# Altium schematic sheet PD1_8.SchDoc: Sample Sheet Title
size B; Date: MM/DD/YYYY; Author: Sample Author; Organization: ORGANIZATION; Address1: ADDRESS 1; Address2: ADDRESS 2; Address3: ADDRESS 3; Address4: ADDRESS 4; Revision: -; SheetNumber: 1; SheetTotal: 1; ENG_APP_DATE: --/--/--; DSN_APP_DATE: --/--/--; CHK_APP_DATE: --/--/--
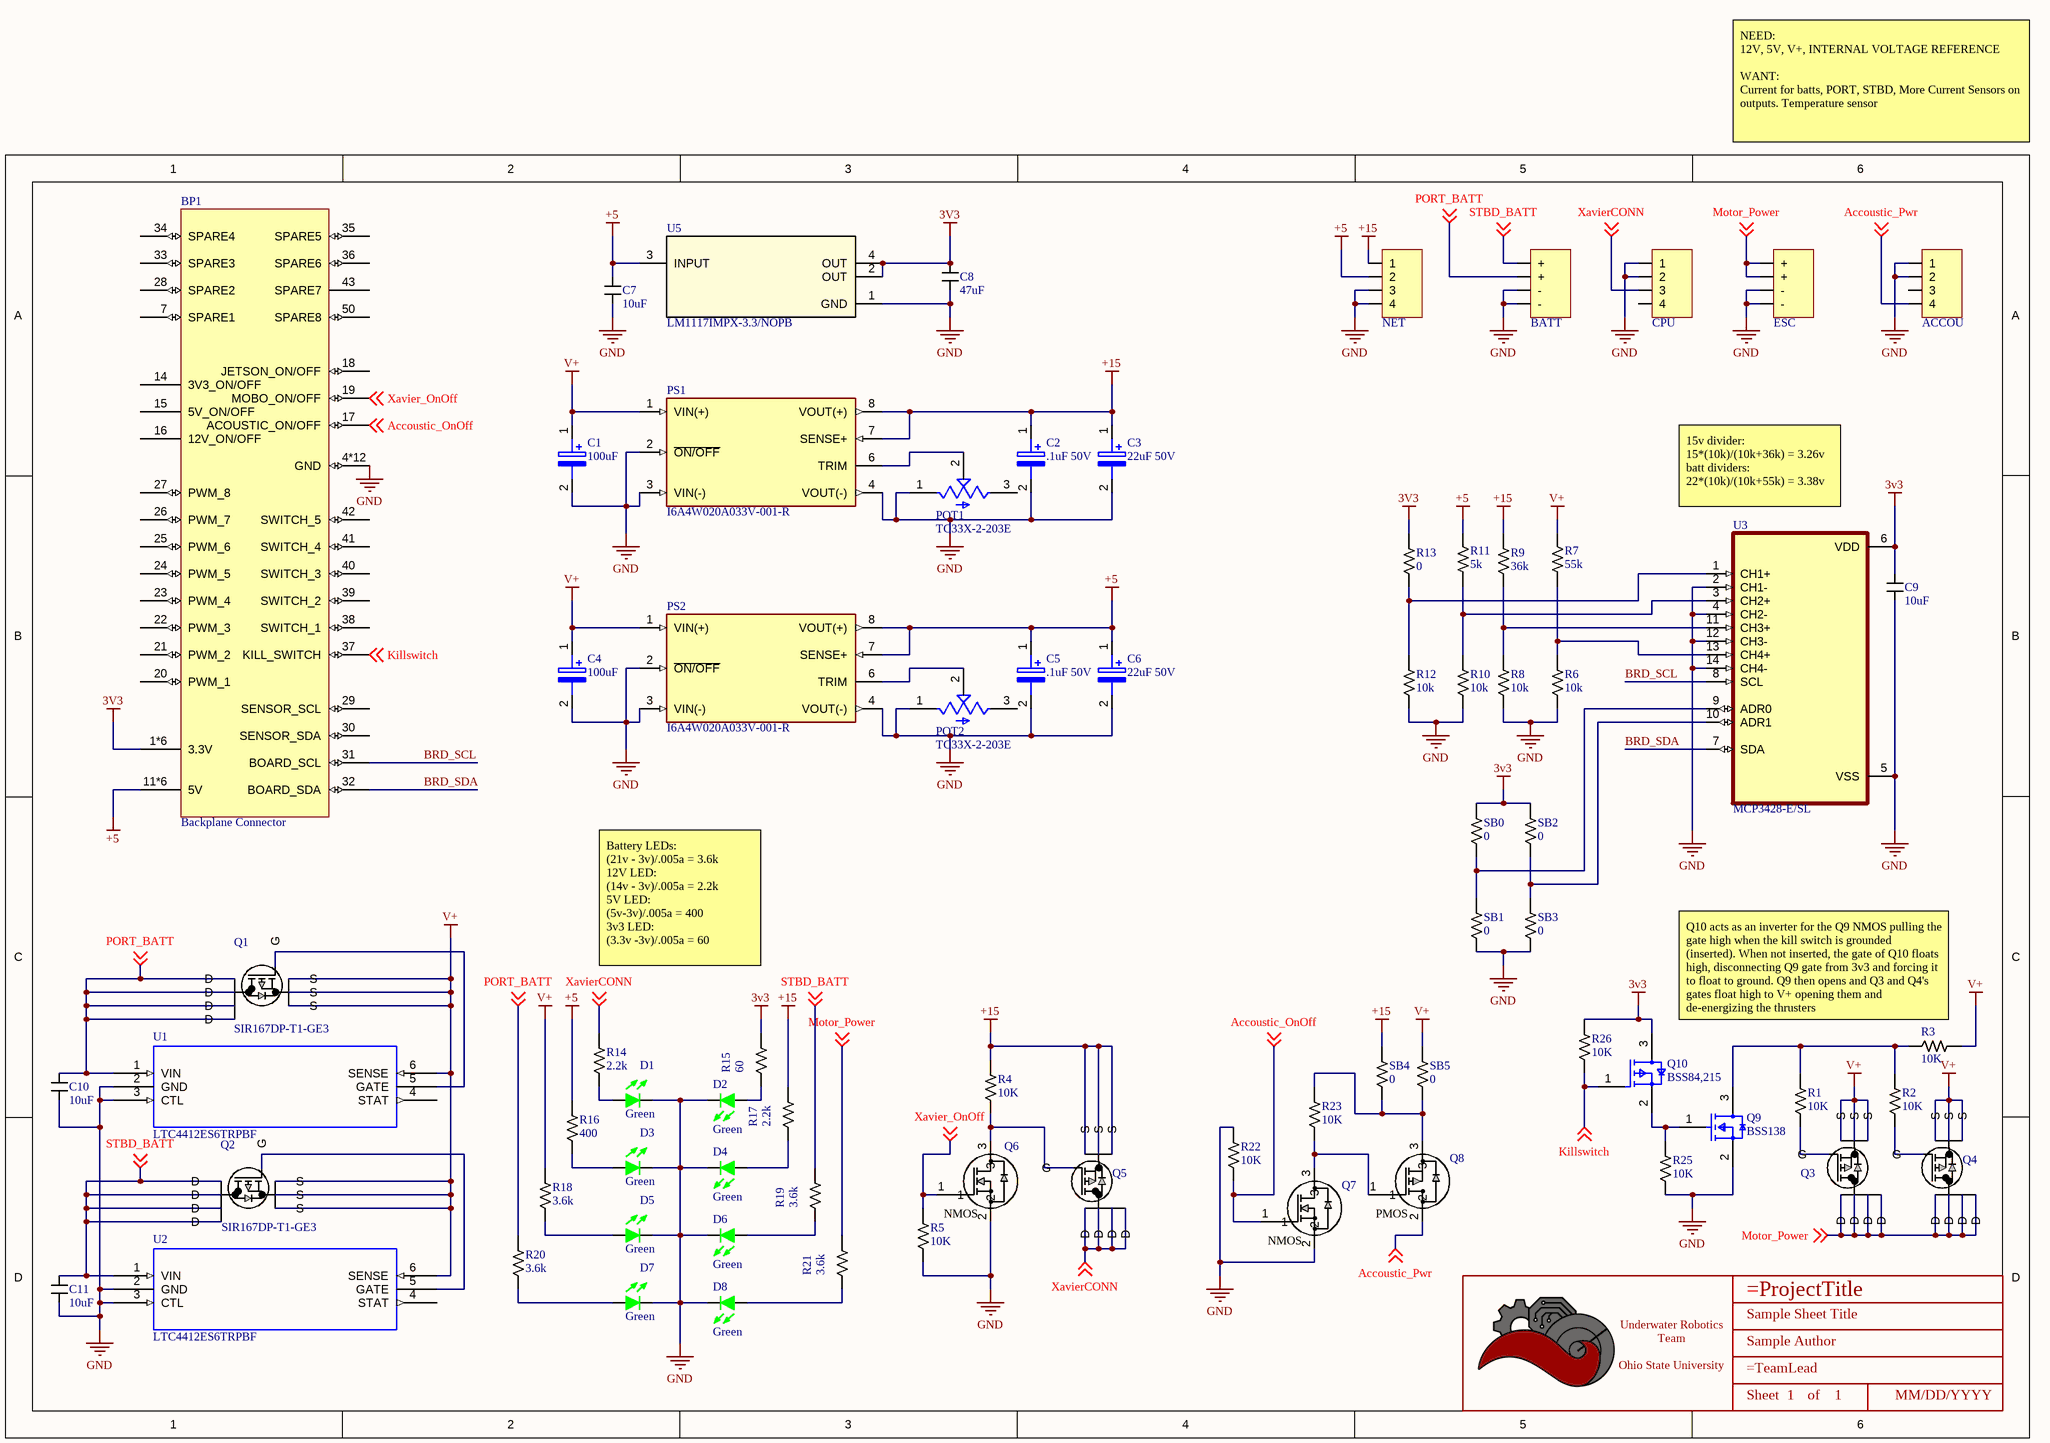
[diagram p0: PD1_8.SchDoc]

## Parts
*  Title_Block  [LOGO]  (value not drawn)  (graphical)
ACCOU  4 POS R/A  [CONN_MOLEX_MINIFIT JR_4 POS_R/A]  (value not drawn)
BATT  4 POS R/A  [CONN_ANDERSON_PP45_4 POS_R/A]  (value not drawn)
BP1  Backplane Connector  [BACKPLANE_EDGE_CONN]
C1  100uF  [CAPAE430X550N]
C2  .1uF 50V  [CAPAE430X550N]
C3  22uF 50V  [CAPAE430X550N]
C4  100uF  [CAPAE430X550N]
C5  .1uF 50V  [CAPAE430X550N]
C6  22uF 50V  [CAPAE430X550N]
C7  Value (uF): 10uF  [CAPACITOR_0603]  (hidden comment: 10uF Ceramic 6.3V)
C8  value 47uF  [CAPACITOR_0603]  (hidden comment: 47uF Ceramic 6.3V)
C9  Value (uF): 10uF  [CAPACITOR_0603]  (hidden comment: 10uF Ceramic 6.3V)
C10  Value (uF): 10uF  [CAPACITOR_0603]  (hidden comment: 10uF Ceramic 6.3V)
C11  Value (uF): 10uF  [CAPACITOR_0603]  (hidden comment: 10uF Ceramic 6.3V)
CPU  4 POS R/A  [CONN_MOLEX_MINIFIT JR_4 POS_R/A]  (value not drawn)
D1  Color: Green  [LED_0603]  (hidden comment: IN-S63AT5G)
D2  Color: Green  [LED_0603]  (hidden comment: IN-S63AT5G)
D3  Color: Green  [LED_0603]  (hidden comment: IN-S63AT5G)
D4  Color: Green  [LED_0603]  (hidden comment: IN-S63AT5G)
D5  Color: Green  [LED_0603]  (hidden comment: IN-S63AT5G)
D6  Color: Green  [LED_0603]  (hidden comment: IN-S63AT5G)
D7  Color: Green  [LED_0603]  (hidden comment: IN-S63AT5G)
D8  Color: Green  [LED_0603]  (hidden comment: IN-S63AT5G)
ESC  4 POS R/A  [CONN_ANDERSON_PP45_4 POS_R/A]  (value not drawn)
NET  4 POS R/A  [CONN_MOLEX_MINIFIT JR_4 POS_R/A]  (value not drawn)
POT1  TC33X-2-203E  [TRIM_TC33X-2-203E]
POT2  TC33X-2-203E  [TRIM_TC33X-2-203E]
PS1  I6A4W020A033V-001-R  [CONV_I6A4W020A033V-001-R]
PS2  I6A4W020A033V-001-R  [CONV_I6A4W020A033V-001-R]
Q1  SIR167DP-T1-GE3  [MOSFET_7DP-T1-GE3_VIS]
Q2  SIR167DP-T1-GE3  [MOSFET_7DP-T1-GE3_VIS]
Q3  SIR167DP-T1-GE3  [MOSFET_7DP-T1-GE3_VIS]  (value not drawn)
Q4  SIR167DP-T1-GE3  [MOSFET_7DP-T1-GE3_VIS]  (value not drawn)
Q5  SIR167DP-T1-GE3  [MOSFET_7DP-T1-GE3_VIS]  (value not drawn)
Q6  PMV13XNEAR  [SOT-23-3]  (value not drawn)
Q7  MOSFET N-Ch 20V 7.3A TO-236AB  [SOT-23-3]  (value not drawn)
Q8  MOSFET P-CHANNEL 20V 4.7A SOT23  [SOT-23-3]  (value not drawn)
Q9  BSS138  [FP-318-08-IPC_B]
Q10  BSS84,215  [FP-SOT23-MFG]
R1  Value  (Ohms): 10K  [RESISTOR_0603]  (hidden comment: 10k Ohm 5% 1/10W)
R2  Value  (Ohms): 10K  [RESISTOR_0603]  (hidden comment: 10k Ohm 5% 1/10W)
R3  Value  (Ohms): 10K  [RESISTOR_0603]  (hidden comment: 10k Ohm 5% 1/10W)
R4  Value  (Ohms): 10K  [RESISTOR_0603]  (hidden comment: 10k Ohm 5% 1/10W)
R5  Value  (Ohms): 10K  [RESISTOR_0603]  (hidden comment: 10k Ohm 5% 1/10W)
R6  Value  (Ohms): 10k  [RESISTOR_0603]  (hidden comment: 0 Ohm Jumper No Fit)
R7  Value  (Ohms): 55k  [RESISTOR_0603]  (hidden comment: 0 Ohm Jumper No Fit)
R8  Value  (Ohms): 10k  [RESISTOR_0603]  (hidden comment: 0 Ohm Jumper No Fit)
R9  Value  (Ohms): 36k  [RESISTOR_0603]  (hidden comment: 0 Ohm Jumper No Fit)
R10  Value  (Ohms): 10k  [RESISTOR_0603]  (hidden comment: 0 Ohm Jumper No Fit)
R11  Value  (Ohms): 5k  [RESISTOR_0603]  (hidden comment: 0 Ohm Jumper No Fit)
R12  Value  (Ohms): 10k  [RESISTOR_0603]  (hidden comment: 0 Ohm Jumper No Fit)
R13  Value  (Ohms): 0  [RESISTOR_0603]  (hidden comment: 0 Ohm Jumper No Fit)
R14  Value  (Ohms): 2.2k  [RESISTOR_0603]  (hidden comment: 0 Ohm Jumper No Fit)
R15  Value  (Ohms): 60  [RESISTOR_0603]  (hidden comment: 0 Ohm Jumper No Fit)
R16  Value  (Ohms): 400  [RESISTOR_0603]  (hidden comment: 0 Ohm Jumper No Fit)
R17  Value  (Ohms): 2.2k  [RESISTOR_0603]  (hidden comment: 0 Ohm Jumper No Fit)
R18  Value  (Ohms): 3.6k  [RESISTOR_0603]  (hidden comment: 0 Ohm Jumper No Fit)
R19  Value  (Ohms): 3.6k  [RESISTOR_0603]  (hidden comment: 0 Ohm Jumper No Fit)
R20  Value  (Ohms): 3.6k  [RESISTOR_0603]  (hidden comment: 0 Ohm Jumper No Fit)
R21  Value  (Ohms): 3.6k  [RESISTOR_0603]  (hidden comment: 0 Ohm Jumper No Fit)
R22  Value  (Ohms): 10K  [RESISTOR_0603]  (hidden comment: 10k Ohm 5% 1/10W)
R23  Value  (Ohms): 10K  [RESISTOR_0603]  (hidden comment: 10k Ohm 5% 1/10W)
R25  Value  (Ohms): 10K  [RESISTOR_0603]  (hidden comment: 10k Ohm 5% 1/10W)
R26  Value  (Ohms): 10K  [RESISTOR_0603]  (hidden comment: 10k Ohm 5% 1/10W)
SB0  Value  (Ohms): 0  [RESISTOR_0603]  (hidden comment: 0 Ohm Jumper No Fit)
SB1  Value  (Ohms): 0  [RESISTOR_0603]  (hidden comment: 0 Ohm Jumper No Fit)
SB2  Value  (Ohms): 0  [RESISTOR_0603]  (hidden comment: 0 Ohm Jumper No Fit)
SB3  Value  (Ohms): 0  [RESISTOR_0603]  (hidden comment: 0 Ohm Jumper No Fit)
SB4  Value  (Ohms): 0  [RESISTOR_0603]  (hidden comment: 0 Ohm Jumper No Fit)
SB5  Value  (Ohms): 0  [RESISTOR_0603]  (hidden comment: 0 Ohm Jumper No Fit)
U1  LTC4412ES6TRPBF  [TSOT-23_S6]
U2  LTC4412ES6TRPBF  [TSOT-23_S6]
U3  MCP3428-E/SL  [SOIC127P600X175-14N]
U5  LM1117IMPX-3.3/NOPB  [SOT-223-4]

## Nets
3V3: BP1.1*6(3.3V) C8.1 C9.1 Q10.3(D) R13.1 R15.1 R26.1 SB0.1 SB2.1 U3.6(VDD) U5.2(OUT) U5.4(OUT)
+5: BP1.11*6(5V) C5.1(POS) C6.1(POS) C7.1 NET.2 PS2.7(SENSE+) PS2.8(VOUT(+)) R11.2 R16.1 U5.3(INPUT)
+15: C2.1(POS) C3.1(POS) NET.1 PS1.7(SENSE+) PS1.8(VOUT(+)) Q5.1(S) Q5.2(S) Q5.3(S) R4.1 R9.1 R17.1 SB4.1
GND: ACCOU.1 ACCOU.2 BATT.3(-) BATT.4(-) BP1.4*12(GND) C1.2(NEG) C2.2(NEG) C3.2(NEG) C4.2(NEG) C5.2(NEG) C6.2(NEG) C7.2 C8.2 C9.2 C10.2 C11.2 CPU.1 CPU.2 D1.2 D2.2 D3.2 D4.2 D5.2 D6.2 D7.2 D8.2 ESC.3(-) ESC.4(-) NET.3 NET.4 POT1.1(CCW) POT2.1(CCW) PS1.2(~{ON/OFF}) PS1.3(VIN(-)) PS1.4(VOUT(-)) PS2.2(~{ON/OFF}) PS2.3(VIN(-)) PS2.4(VOUT(-)) Q6.2 Q7.2 Q9.2(S) R5.2 R6.2 R8.2 R10.2 R12.2 R22.1 R25.2 SB1.2 SB3.2 U1.2(GND) U1.3(CTL) U2.2(GND) U2.3(CTL) U3.2(CH1-) U3.4(CH2-) U3.5(VSS) U3.12(CH3-) U3.14(CH4-) U5.1(GND)
V+: C1.1(POS) C4.1(POS) PS1.1(VIN(+)) PS2.1(VIN(+)) Q1.1(S) Q1.2(S) Q1.3(S) Q2.1(S) Q2.2(S) Q2.3(S) Q3.1(S) Q3.2(S) Q3.3(S) Q4.1(S) Q4.2(S) Q4.3(S) R3.1 R7.2 R18.1 SB5.1 U1.6(SENSE) U2.6(SENSE)
Accoustic_OnOff: BP1.17(ACOUSTIC_ON/OFF) Q7.1 R22.2 ; off-sheet Accoustic_OnOff
Accoustic_Pwr: ACCOU.4 Q8.2 ; off-sheet Accoustic_Pwr
BRD_SCL: BP1.31(BOARD_SCL) U3.8(SCL)
BRD_SDA: BP1.32(BOARD_SDA) U3.7(SDA)
Killswitch: BP1.37(KILL_SWITCH) Q10.1(G) R26.2 ; off-sheet Killswitch
Motor_Power: ESC.1(+) ESC.2(+) Q3.5(D) Q3.6(D) Q3.7(D) Q3.8(D) Q4.5(D) Q4.6(D) Q4.7(D) Q4.8(D) R21.1 ; off-sheet Motor_Power
PORT_BATT: BATT.2(+) C10.1 Q1.5(D) Q1.6(D) Q1.7(D) Q1.8(D) R20.1 U1.1(VIN) ; off-sheet PORT_BATT
STBD_BATT: BATT.1(+) C11.1 Q2.5(D) Q2.6(D) Q2.7(D) Q2.8(D) R19.1 U2.1(VIN) ; off-sheet STBD_BATT
Xavier_OnOff: BP1.19(MOBO_ON/OFF) Q6.1 R5.1 ; off-sheet Xavier_OnOff
XavierCONN: CPU.3 Q5.5(D) Q5.6(D) Q5.7(D) Q5.8(D) R14.1 ; off-sheet XavierCONN
NetD1_1: D1.1 R14.2
NetD2_1: D2.1 R15.2
NetD3_1: D3.1 R16.2
NetD4_1: D4.1 R17.2
NetD5_1: D5.1 R18.2
NetD6_1: D6.1 R19.2
NetD7_1: D7.1 R20.2
NetD8_1: D8.1 R21.2
NetPOT1_2: POT1.2(W) PS1.6(TRIM)
NetPOT2_2: POT2.2(W) PS2.6(TRIM)
NetQ1_4: Q1.4(G) U1.5(GATE)
NetQ2_4: Q2.4(G) U2.5(GATE)
NetQ3_4: Q3.4(G) R1.2
NetQ4_4: Q4.4(G) R2.2
NetQ5_4: Q5.4(G) Q6.3 R4.2
NetQ7_3: Q7.3 Q8.1 R23.2
NetQ8_3: Q8.3 R23.1 SB4.2 SB5.2
NetQ9_1: Q9.1(G) Q10.2(S) R25.1
NetQ9_3: Q9.3(D) R1.1 R2.1 R3.2
NetR6_1: R6.1 R7.1 U3.13(CH4+)
NetR8_1: R8.1 R9.2 U3.11(CH3+)
NetR10_1: R10.1 R11.1 U3.3(CH2+)
NetR12_1: R12.1 R13.2 U3.1(CH1+)
NetSB0_2: SB0.2 SB1.1 U3.9(ADR0)
NetSB2_2: SB2.2 SB3.1 U3.10(ADR1)

Not connected (* = marked no-connect by the designer): ACCOU 3; BP1 7(SPARE1) 14(3V3_ON/OFF) 15(5V_ON/OFF) 16(12V_ON/OFF) 18(JETSON_ON/OFF) 20(PWM_1) 21(PWM_2) 22(PWM_3) 23(PWM_4) 24(PWM_5) 25(PWM_6) 26(PWM_7) 27(PWM_8) 28(SPARE2) 29(SENSOR_SCL) 30(SENSOR_SDA) 33(SPARE3) 34(SPARE4) 35(SPARE5) 36(SPARE6) 38(SWITCH_1) 39(SWITCH_2) 40(SWITCH_3) 41(SWITCH_4) 42(SWITCH_5) 43(SPARE7) 50(SPARE8); CPU 4; POT1 3(CW); POT2 3(CW); U1 4(STAT); U2 4(STAT)

## Notes on the sheet
- NEED:
  12V, 5V, V+, INTERNAL VOLTAGE REFERENCE
  WANT:
  Current for batts, PORT, STBD, More Current Sensors on outputs. Temperature sensor
- (near U3) 15v divider:
  15*(10k)/(10k+36k) = 3.26v
  batt dividers:
  22*(10k)/(10k+55k) = 3.38v
- Battery LEDs:
  (21v - 3v)/.005a = 3.6k
  12V LED:
  (14v - 3v)/.005a = 2.2k
  5V LED:
  (5v-3v)/.005a = 400
  3v3 LED:
  (3.3v -3v)/.005a = 60
- (near R3) Q10 acts as an inverter for the Q9 NMOS pulling the gate high when the kill switch is grounded (inserted). When not inserted, the gate of Q10 floats high, disconnecting Q9 gate from 3v3 and forcing it to float to ground. Q9 then opens and Q3 and Q4's gates float high to V+ opening them and de-energizing the thrusters
- DWG. NO.
- REV.
- SHT.
- THIS DOCUMENT AND THE DATA DISCLOSED HEREIN OR HEREWITH IS THE PROPERTY OF ALTIUM LIMITED AND MAY BE FREELY DISTRIBUTED IN WHOLE. NO RIGHTS ARE RESERVED OR EXPRESS OR IMPLIED WARANTEE GIVEN.
- REVISION
- DESCRIPTION
- DATE
- APPROVED
- ENG:
- APPROVALS
- PROJECT
- DSN:
- CHK:
- REFERENCE DOCUMENTS
- PROJECT REVISION:
- TITLE
- DOCUMENT REVISION:
- DESIGN ITEM:
- BOM:
- FAB DWG:
- PCB DWG:
- ASSY DWG:
- SCALE:
- SIZE
- B
- CAGE CODE
- FILE NAME
- DWG NO.
- SHEET
- OF
- REV
- (in symbol PMV13XNEAR) NMOS
- (in symbol Title_Block) Underwater Robotics Team / Ohio State University; Sheet; of
- (in symbol TSM500P02CX) PMOS

## Library data of the parts
* = Title_Block: UWRT Schematic Title Block Template / Created June 2021, Dylan Trainor
ACCOU CPU NET = CONN_MOLEX_MINIFIT JR_4POS_R/A: Molex Minifit Jr. 5569 / 4 Pos R/A Natural; Pitch: 4.2mm; Configuration: Right Angle; Current Per Pin: 13A; Number of Positions: 4; Supplier Part Number 1: WM13112-ND; Supplier 1: Digi-Key; Manufacturer: Molex; Color: Natural; Created By: Flip B; ComponentLink1Description: Datasheet; ComponentLink1URL: https://www.molex.com/pdm_docs/sd/026013115_sd.pdf; Series: Minifit Jr 5569
BATT ESC = CONN_ANDERSON_2x2_R/A: Anderson PP45 / 4 Pos R/A Red/Black; Pitch: 7.9mm; Configuration: Right Angle; Current Per Pin: 45A; Number of Positions: 4; Manufacturer: Anderson; Color: Red/Black; Created By: Flip B; ComponentLink1Description: Datasheet; ComponentLink1URL: https://www.andersonpower.com/content/dam/app/ecommerce/product-pdfs/DS-PP1545.pdf; Series: PowerPole 45; Supplier 1: Digi-Key; Supplier Part Number 1: 2243-1337G1-ND; Supplier 2: Digi-Key; Supplier Part Number 2: 2243-1336G1-ND; Supplier 3: Digi-Key; Supplier Part Number 3: 2243-1327-BK-ND; Supplier 4: Digi-Key; Supplier Part Number 4: A102007-ND
BP1 = BACKPLANE_EDGE_CONN: Titan Backplane Edge Connector; pin to pad: 1*6>1+2+3+54+55+56 4*12>4+5+6+8+9+10+47+48+49+51+52+53 11*6>11+12+13+44+45+46
C1-C6 = 865250340002: 4.7ÂµF 16V Aluminum Electrolytic Capacitors Radial, Can - SMD 2000 Hrs @ 85Â°C; MF: Wurth Elektronik; Value: *; SnapEDA_Link: https://www.snapeda.com/parts/865250340002/W%C3%BCrth%20Elektronik/view-part/5002976/?ref=snap; MP: 865250340002; Purchase-URL: https://pricing.snapeda.com/search/part/865250340002/?ref=eda; Check_prices: https://www.snapeda.com/parts/865250340002/W%C3%BCrth%20Elektronik/view-part/5002976/?ref=eda; Availability: Warning; Price: None; Package: None
C7 C9-C11 = CAPACITOR_10uF_0603: Cap 10uF 6.3V +/-20% / Ceramic 0603; Made By: Flip B; ComponentLink1Description: Digikey; ComponentLink1URL: https://www.digikey.com/en/products/detail/samsung-electro-mechanics/CL10A106MQ8NNNC/3886777; Supplier 1: Digi-Key; Supplier Part Number 1: 1276-1119-1-ND; Tolerance: +/- 20%; Voltage: 6.3V
C8 = CAPACITOR_47uF_0603: Cap 47uF 6.3V +/-20% / Ceramic 0603; Made By: Flip B; ComponentLink1Description: Datsheet; ComponentLink1URL: https://www.mouser.com/datasheet/2/212/KEM_C1002_X7R_SMD-1102033.pdf; Tolerance: +/- 20%; Voltage: 6.3V; Supplier 1: Digi-Key; Supplier Part Number 1: 490-13247-1-ND
D1-D8 = LED_Green_0603_3V: LED Green Vf= 3V If = 0.005A / IN-S63AT5G; Made By: Robert Pafford; Forward Current: 5mA; ComponentLink1Description: Datasheet; ComponentLink1URL: https://www.we-online.de/katalog/datasheet/150060GS75000.pdf; Forward Voltage: 3V; Package: 0603; Supplier 1: Digi-Key; Supplier Part Number 1: 1830-1062-1-ND
POT1 POT2 = TC33X-2-203E: 20 kOhms 0.1W, 1/10W J Lead Surface Mount Trimmer Potentiometer Cermet 1 Turn Top Adjustment; MF: Bourns; Value: *; SnapEDA_Link: https://www.snapeda.com/parts/TC33X-2-203E/Bourns/view-part/312812/?ref=snap; Check_prices: https://www.snapeda.com/parts/TC33X-2-203E/Bourns/view-part/312812/?ref=eda; Digi-Key_Part_Number: TC33X-2-203ECT-ND; Purchase-URL: https://pricing.snapeda.com/search/part/TC33X-2-203E/?ref=eda; Package: 1608 Bourns; MP: TC33X-2-203E
PS1 PS2 = I6A4W020A033V-001-R: Non-Isolated PoL Module DC DC Converter 1 Output 3.3 ~ 15V 20A 9V - 53V Input; MF: TDK-Lambda Americas; Availability: In Stock; Price: None; Package: DIP-8 TDK-Lambda; MP: I6A4W020A033V-001-R; Value: *; SnapEDA_Link: https://www.snapeda.com/parts/I6A4W020A033V-001-R/TDK-Lambda%20Americas%20Inc./view-part/1737324/?ref=snap; Check_prices: https://www.snapeda.com/parts/I6A4W020A033V-001-R/TDK-Lambda%20Americas%20Inc./view-part/1737324/?ref=eda; Purchase-URL: https://pricing.snapeda.com/search/part/I6A4W020A033V-001-R/?ref=eda
Q1-Q5 = SIR167DP-T1-GE3: P-Channel 30 V 60A (Tc) 65.8W (Tc) Surface Mount PowerPAK® SO-8; Mfr_Name: Vishay; Type: DEV; Copyright: Copyright (C) 2022 Ultra Librarian. All rights reserved.; Manufacturer_Part_Number: SIR167DP-T1-GE3; RefDes: RefDes
Q6 = PMV13XNEAR: N-Channel 20 V 7.3A (Ta) 610mW (Ta), 8.3W (Tc) Surface Mount TO-236AB; Vendor: Nexperia USA Inc.; SourceLibrary: ON_Semiconductor_2020-01-13; Vgs (Max): +/- 12 V; Vgs (th): 1.3V @ 250uA; Vdss: 20 V; Rds (on): 15mOhm @ 7.3A, 8V; Amp Rating: 7.3 A; FET Type: N-Channel; Package: SOT23-3L; Manufacturer _Part_Number: PMV13XNEAR; Power Dissipation: 610mW (Ta), 8.3W (Tc); Created By: Dylan T; Supplier 1: Mouser; Supplier Part Number 1: 771-PMV13XNEAR
Q7 = PMV13XNEAR: N-Channel 20 V 7.3A (Ta) 610mW (Ta), 8.3W (Tc) Surface Mount TO-236AB; Vendor: Nexperia USA Inc.; SourceLibrary: ON_Semiconductor_2020-01-13; Vgs (Max): +/- 12 V; Vgs (th): 1.3V @ 250uA; Rds (on): 15mOhm @ 7.3A, 8V; Amp Rating: 7.3 A; FET Type: N-Channel; Package: SOT23-3L; Manufacturer _Part_Number: PMV13XNEAR; Vdss: 20 V; Power Dissipation: 610mW (Ta), 8.3W (Tc); Created By: Dylan T; Supplier 1: Mouser; Supplier Part Number 1: 771-PMV13XNEAR
Q8 = TSM500P02CX: P-Channel 20 V 4.7A (Tc) 1.56W (Tc) Surface Mount SOT-23; Vendor: Taiwan Semiconductor Corporation; Vgs (Max): ±10V; Vgs (th): 800mV @ 250µA; Rds (on): 50mOhm @ 3A, 4.5V; Amp Rating: 4.7 A; FET Type: P-Channel; Package: TO-236-3, SC-59, SOT-23-3; Manufacturer_Part_Number: TSM500P02CX; Vdss: 20 V; Power Dissipation: 1.56W (Tc); Created By: Robert Pafford; Supplier 1: Digi-Key; Supplier Part Number 1: TSM500P02CXRFGCT-ND
Q9 = CMP-07173-000101-1: MOSFET N-CH 50V 220MA SOT-23; Turn-Off Delay Time: 20ns; Element Configuration: Single; Rds On Max: 3.5R; Gate to Source Voltage (Vgs): 20V; Threshold Voltage: 1.3V; Number of Elements: 1; Power Dissipation: 360mW; Rise Time: 9ns; Turn-On Delay Time: 2.5ns; Input Capacitance: 27pF; On-State Resistance: 6R; Lead Free: Lead Free; Length: 2.92mm; Width: 1.3mm; Drain to Source Breakdown Voltage: 50V; Min Operating Temperature: -55°C; REACH SVHC: No SVHC; Packaging: Tape and Reel; Radiation Hardening: No; Height: 0.93mm; Drain to Source Voltage (Vdss): 50V; Current Rating: 220mA; Voltage Rating (DC): 50V; Weight: 0.03g; Continuous Drain Current (ID): 220mA; Number of Pins: 3; Nominal Vgs: 1.3V; Max Power Dissipation: 360mW; Fall Time: 9ns; Drain to Source Resistance: 3.5R; Contact Plating: Tin; Case/Package: SOT-23; Package Quantity: 1; Dual Supply Voltage: 50V; Mount: Surface Mount; Termination: SMD/SMT; Max Operating Temperature: 150°C
Q10 = CMP-14409-000006-1: MOSFET P-CH 50V 130MA SOT-23; Manufacturer: Nexperia USA Inc.; Drain To Source Breakdown Voltage: -50V; Max Junction Temp: +150°C; Threshold Vgs Min: -0.8V; Turn On Delay Time: 3ns; Power Dissipation: 250mW; Turn Off Delay Time: 7ns; Gate To Source Voltage: 20V; Number Of Channels: 1; Input Capacitace At Vds: 25pF @ -25V; Threshold Vgs Max: -2V; Continuous Drain Current: -130mA; Depletion Mode: False; Drain To Source Resistance: 6Ω; Rthja Max: 500K/W; Octopart: https://octopart.com/bss84%2C215-nexperia-78739375; Ipc Land Pattern Name: SOT95P230X100-3; Drain To Source Voltage: -50V; Lead Free: Yes; Temperature Range High: +150°C; Automotive: No; Device Class L2: Transistors; Manufacturer Part Number: BSS84,215; Package: SOT23; ComponentLink2URL: https://assets.nexperia.com/documents/data-sheet/BSS84.pdf; Category: Trans; RoHS: TRUE; Temperature Range Low: -65°C; ComponentLink2Description: Datasheet; Device Class L1: Discrete Semiconductors; Number Of P Channels: 1; Device Class L3: MOSFETs; Height: 1.1mm; Digikey Description: MOSFET P-CH 50V 130MA SOT-23; Temperature: -65°C to +150°C; Footprint Url: https://assets.nexperia.com/documents/outline-drawing/SOT23.pdf
R1-R5 R22 R23 R25 R26 = RESISTOR_10K_0603: RES 10k OHM 5% 1/10W 0603; Tolerance: +/- 5%; Wattage: 1/8W; Made By: Robert Pafford; ComponentLink1Description: Datasheet; ComponentLink1URL: https://www.bourns.com/docs/product-datasheets/CRxxxxx.pdf; Supplier: Digikey; Digikey Part Numer: CR0603-JW-104ELFTR-ND; Supplier 1: Digi-Key; Supplier Part Number 1: 2019-RK73B1JTTD103JCT-ND
R6-R21 SB0-SB5 = JUMPER_0_0603: 0 Ohm Jumper No Fit for Solder Bridge; Made By: Robert Pafford; ComponentLink1Description: Digikey; ComponentLink1URL: https://www.digikey.com/en/products/detail/koa-speer-electronics-inc/RK73B1JTTD101J/9844701
U1 U2 = LTC4412ES6TRPBF: OR Controller Source Selector Switch P-Channel 2:1 TSOT-23-6; MP: LTC4412ES6#TRPBF; MF: Analog Devices; Price: None; Availability: Good; Mouser-Purchase-URL: https://snapeda.com/shop?store=Mouser&id=4343773; Arrow_Europe-Purchase-URL: https://snapeda.com/shop?store=Arrow+Europe&id=4343773; DigiKey-Purchase-URL: https://snapeda.com/shop?store=DigiKey&id=4343773; Package: SOT-23-6 Analog Devices; SnapEDA_Link: https://www.snapeda.com/parts/LTC4412ES6%23TRPBF/Analog%20Devices/view-part/4343773/?ref=snap; Value: *
U3 = MCP3428-E/SL: 16 Bit Analog to Digital Converter 4 Input 1 Sigma-Delta 14-SOIC; MF: Microchip; Package: SOIC-14 Microchip; SnapEDA_Link: https://www.snapeda.com/parts/MCP3428-E/SL/Microchip/view-part/13249/?ref=snap; MP: MCP3428-E/SL; Price: None; Availability: Unavailable; Value: *
U5 = LM1117IMPX-3.3/NOPB: IC REG LIN 3.3V 800MA SOT223-4; PartNumber: LM1117IMP-3.3/NOPB; Manufacturer: Texas Instruments; Vin (Max): 15V; Supplier 1: Digi-Key; Supplier Part Number 1: LM1117IMPX-3.3/NOPBCT-ND; Vout (Min/Fixed): 3.3V; Amp Out: 800mA; Package: SOT-223-4; Created By: Dylan T